# Altium schematic sheet StepperMotors.SchDoc
size A
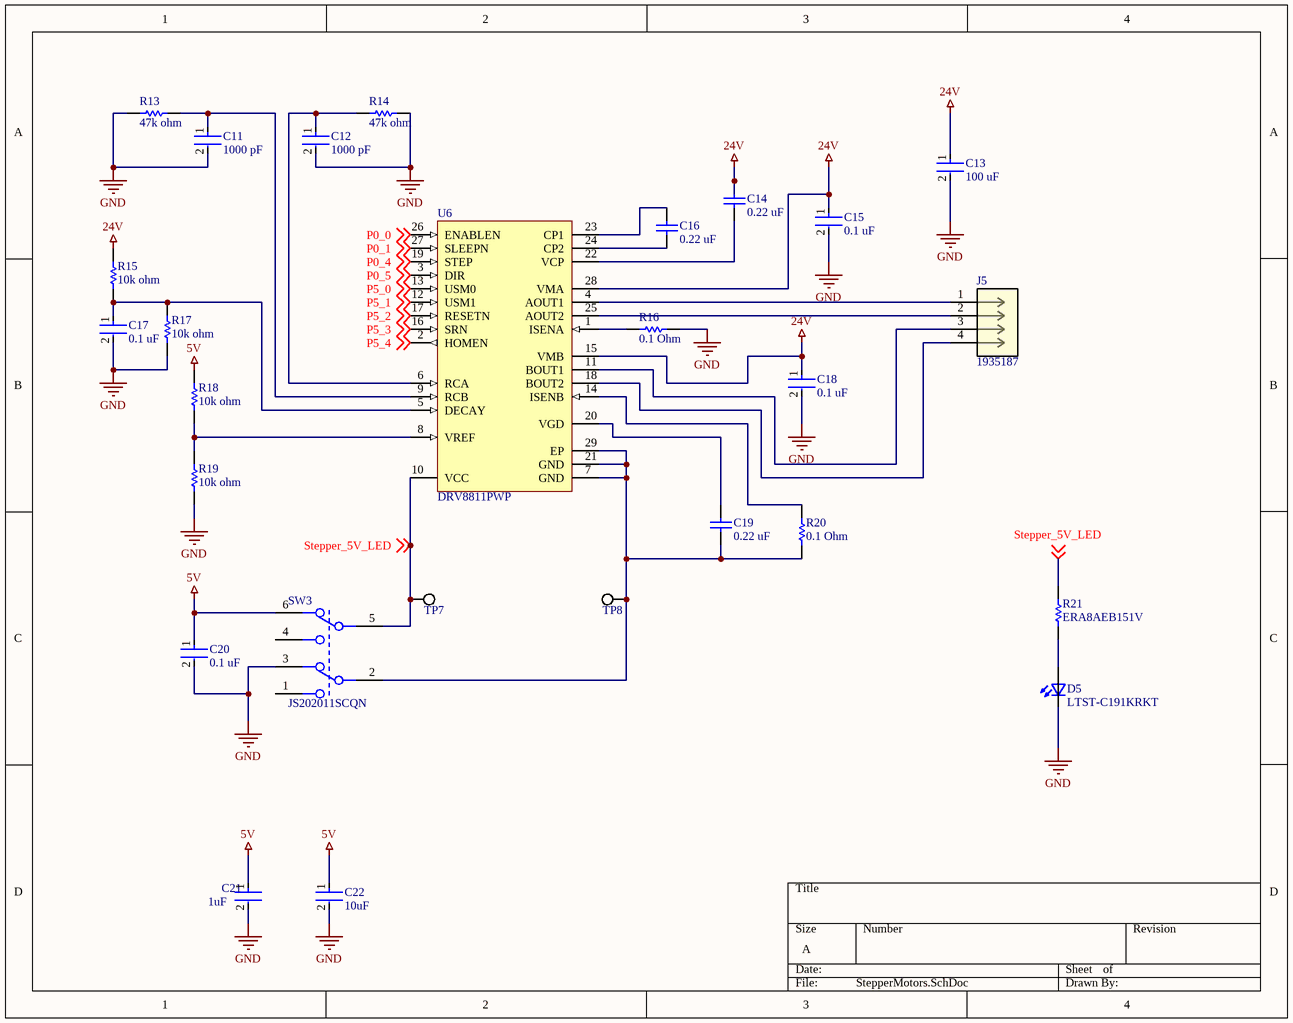
[diagram p0: StepperMotors.SchDoc]

## Parts
C11  1000 pF  [FP-0805-L_2_01_0_2-W_1_25-IPC_C]
C12  1000 pF  [FP-0805-L_2_01_0_2-W_1_25-IPC_C]
C13  100 uF  [FP-0805-L_2_0_0_2-W_1_25-IPC_A]
C14  0.22 uF  [CAPC2013X94X50ML20T25]
C15  0.1 uF  [FP-CL21-IPC_C]
C16  0.22 uF  [CAPC2013X94X50ML20T25]
C17  0.1 uF  [FP-CL21-IPC_C]
C18  0.1 uF  [FP-CL21-IPC_C]
C19  0.22 uF  [CAPC2013X94X50ML20T25]
C20  0.1 uF  [FP-CL21-IPC_C]
C21  1uF  [FP-CC0805-0_85-MFG]
C22  value 10uF  [FP-C0805C-DG-MFG]  (hidden comment: C0805C106K8PACTU)
D5  LTST-C191KRKT  [0603]
J5  1935187  [CONN_1935187_PXC]
R13  47k ohm  [RESC2013X70X40ML20T20]
R14  47k ohm  [RESC2013X70X40ML20T20]
R15  10k ohm  [RESC2013X60X35ML10T20]
R16  0.1 Ohm  [RESC2013X50X40ML20T20]
R17  10k ohm  [RESC2013X60X35ML10T20]
R18  10k ohm  [RESC2013X60X35ML10T20]
R19  10k ohm  [RESC2013X60X35ML10T20]
R20  0.1 Ohm  [RESC2013X50X40ML20T20]
R21  ERA8AEB151V  [RESC3216X70X50ML20T25]
SW3  JS202011SCQN  [FP-JS202011SCQN-MFG]
TP7  5019  [KSTN-5019_V]  (value not drawn)
TP8  5019  [KSTN-5019_V]  (value not drawn)
U6  DRV8811PWP  [PWP0028C_M]

## Nets
5V: C20.1 C21.1 C22.1 R18.2 SW3.6
24V: C13.1 C14.2 C15.1 C18.1 R15.2 U6.15(VMB) U6.28(VMA)
GND: C11.2 C12.2 C13.2 C15.2 C17.2 C18.2 C20.2 C21.2 C22.2 D5.1(K2) R13.1 R14.2 R16.2 R17.1 R19.1 SW3.3
P0_0: U6.26(ENABLEN) ; off-sheet P0_0
P0_1: U6.27(SLEEPN) ; off-sheet P0_1
P0_4: U6.19(STEP) ; off-sheet P0_4
P0_5: U6.3(DIR) ; off-sheet P0_5
P5_0: U6.13(USM0) ; off-sheet P5_0
P5_1: U6.12(USM1) ; off-sheet P5_1
P5_2: U6.17(RESETN) ; off-sheet P5_2
P5_3: U6.16(SRN) ; off-sheet P5_3
P5_4: U6.2(HOMEN) ; off-sheet P5_4
Stepper_5V_LED: R21.2 SW3.5 TP7.1 U6.10(VCC) ; off-sheet Stepper_5V_LED
NetC11_1: C11.1 R13.2 U6.9(RCB)
NetC12_1: C12.1 R14.1 U6.6(RCA)
NetC14_1: C14.1 U6.22(VCP)
NetC16_1: C16.1 U6.24(CP2)
NetC16_2: C16.2 U6.23(CP1)
NetC17_1: C17.1 R15.1 R17.2 U6.5(DECAY)
NetC19_1: C19.1 R20.1 SW3.2 TP8.1 U6.7(GND) U6.21(GND) U6.29(EP)
NetC19_2: C19.2 U6.20(VGD)
NetD5_2: D5.2(A2) R21.1
NetJ5_1: J5.1 U6.4(AOUT1)
NetJ5_2: J5.2 U6.25(AOUT2)
NetJ5_3: J5.3 U6.11(BOUT1)
NetJ5_4: J5.4 U6.18(BOUT2)
NetR16_1: R16.1 U6.1(ISENA)
NetR18_1: R18.1 R19.2 U6.8(VREF)
NetR20_2: R20.2 U6.14(ISENB)

Not connected (* = marked no-connect by the designer): SW3 1 4

## Library data of the parts
C11 C12 = CMP-2007-04270-2: General Purpose Ceramic Capacitor, 0805, 1nF, 5%, C0G, 30ppm/°C, 50V; Insulation Resistance: 100GR; Capacitance: 1nF; Voltage Rating (DC): 50V; Packaging: Tape and Reel; Min Operating Temperature: -55°C; Series: -; Construction: Flat; Tolerance: 5%; RoHS Compliant: Yes; Package Quantity: 1; Case Code (Metric): 2012; Lead Free: Lead Free; Thickness: 0.037inch; REACH SVHC: No SVHC; Temperature Coefficient: 30ppm/°C; Case/Package: 0805; Case Code: 0805; Radiation Hardening: No; Size: 0.94mm; Height: 0.94mm; Width: 0.049inch; Number of Pins: 2; Depth: 1.25mm; Dielectric: C0G; Contact Plating: Tin; Length: 2.01mm; Voltage: 50V; Voltage Rating: 50V; Max Operating Temperature: 125°C; Mount: Surface Mount; Case Code (Imperial): 0805; Termination: SMD/SMT
C13 = CMP-14477-004891-2: Multilayer Ceramic Capacitor 100uF 2.5V X5R 20% SMD 0805 T/R; Type: General Purpose; Voltage Rating: 2.5V; Case Code (Metric): 2012; Weight: 0.000194oz; Capacitance: 100uF; Termination: SMD/SMT; Case/Package: 0805; Dielectric: X5R; Tolerance: 20%; Package Quantity: 3000; Case Code (Imperial): 0805; Width: 1.25mm; Height: 1.25mm; Thickness: 0.053inch; Mount: Surface Mount; Min Operating Temperature: -55°C; Max Operating Temperature: 85°C; Voltage Rating (DC): 2.5V; Length: 0.079inch; Packaging: Tape and Reel; RoHS Compliant: Yes
C14 C16 C19 = CMP-2007-04189-1: Part Number: 08051C224KAT2A; Manufacturer: AVX Interconnect / Elco
C15 C17 C18 C20 = CMP-2000-05017-2: CL21 Series 0805 100nF 50V ±10% Tolerance X7R Multilayer Ceramic Chip Capacitor; Depth: 1.25mm; Height: 0.85mm; Width: 0.049inch; Tolerance: 10%; Case Code (Metric): 2012; Case Code (Imperial): 0805; Material: Ceramic; Thickness: 0.037inch; Min Operating Temperature: -55°C; Contact Plating: Tin; Length: 2mm; Mount: Surface Mount; Voltage Rating (DC): 50V; Lead Free: Lead Free; Dielectric: X7R; Radiation Hardening: No; Capacitance: 100nF; Voltage Rating: 50V; Case/Package: 0805; Packaging: Tape and Reel; Max Operating Temperature: 125°C; Voltage: 50V
C21 = CMP-03422-000182-1: CAP CER 1UF 10V X7R 0805; Manufacturer: Yageo; Manufacturer Part Number: CC0805KKX7R6BB105; Material: Ceramic; Tolerance: 0.1; Value: 1 uF; ComponentLink2URL: http://www.yageo.com/documents/recent/UPY-GPHC_Y5V_6.3V-to-50V_8.pdf; Automotive: No; Temperature Range Low: -30°C; Octopart: https://octopart.com/cc0805kkx7r6bb105-yageo-42522859; Temperature Characteristic: X7R; RoHS: TRUE; Voltage Rating: 10 V; Capacitance: 1 uF; Package: CC0805-0.85; Device Class L3: Ceramic Capacitors; Category: Cap; Mouser Description: Multilayer Ceramic Capacitors MLCC - SMD/SMT 1.0uF 10V X7R 10%; Temperature Range High: +85°C; Ipc Land Pattern Name: CAPC200125X85; ComponentLink2Description: Datasheet; Temperature: -30°C to +85°C; Height: 0.95mm; Lead Free: Yes; Device Class L1: Passive Components; Device Class L2: Capacitors; Footprint Url: http://www.yageo.com/exep/pages/download/literatures/UPY-C_GEN_24.pdf; Digikey Description: CAP CER 1UF 10V X7R 0805
C22 = CMP-2007-03243-2: CAP CER 10UF 10V X5R 0805; Manufacturer: Kemet; 3DS Part Number: 220-00001; Tolerance: 10%; Temperature Coefficient: 15%; Material: Ceramic; Device Class L2: Capacitors; Device Class L1: Passive Components; ComponentLink2URL: https://content.kemet.com/datasheets/KEM_C1006_X5R_SMD.pdf; Height: 1.4mm; Lead Free: Yes; Manufacturer Part Number: C0805C106K8PACTU; Digikey Description: CAP CER 10UF 10V X5R 0805; Octopart: https://octopart.com/c0805c106k8pactu-kemet-98697; Capacitance: 10uF; Temperature Range Low: -55°C; Temperature: -55°C to +85°C; Automotive: No; Mouser Description: CAP CER 10UF 10V X5R 0805; Ipc Land Pattern Name: CAPC200125X125; Temperature Range High: +85°C; Voltage: 10V; RoHS: TRUE; Device Class L3: Ceramic Capacitors; ComponentLink2Description: Datasheet; Voltage Rating: 10V; Package: C0805C-DG; Temperature Characteristic: X5R; Category: Cap; Supplier 1: Digi-Key; Supplier Part Number 1: 399-C0805C106K8PAC7800CT-ND; Manufacturer 1: KEMET; Manufacturer Part Number 1: C0805C106K8PACTU; Stock 1: 8631846; Pricing 1: 1=0.14000, 10=0.10300, 50=0.05840, 100=0.04830, 500=0.03388, 1000=0.02805 (USD); Mount: Surface Mount; Case/Package: 0805; Number of Pins: 2; Case Code (Imperial): 0805; Case Code (Metric): 2012; Dielectric Material: Ceramic; Contact Plating: Tin,Matte; Min Operating Temperature: -55°C; Max Operating Temperature: 85°C; Packaging: Tape and Reel; Dielectric: X5R; Package Quantity: 1; Voltage Rating (DC): 10V; Series: C; Termination: SMD/SMT; Construction: Flat; Dissipation Factor: 10%; Length: 2mm; Width: 1.2mm; Depth: 1.25mm; Thickness: 0.055inch; Radiation Hardening: No; REACH SVHC: No SVHC; RoHS Compliant: Yes
D5 = LTST-C191KRKT: http://octopart.com/ltst-c190krkt-lite-on-549893; Package: None; MP: LTST-C191KRKT; Value: *; Availability: Unavailable; Price: None
J5 = 1935187: No Description Available; Mfr_Name: Phoenix Contact; RefDes: RefDes; Type: Type
R13 R14 = CMP-2001-00421-1: Manufacturer: Panasonic; Part Number: ERJ-6GEYJ473V
R15 R17-R19 = CMP-2000-05025-1: Chip Resistor, 10 KOhm, +/- 5%, 0.125 W, -55 to 155 degC, 0805 (2012 Metric), RoHS, Tape and Reel; Manufacturer: Yageo; Resistor Element Type: ThickFilm; Voltage Rating: 150V; Product Range: RCSeries; SVHC: ToBeAdvised; Resistor Case Style: 0805[2012Metric]; Temperature Coefficient: ±100ppm/degC; Power Rating: 250mW; Resistance: 10kohm; Automotive Qualification Standard: -; Datasheet Version: REV. 2, 09/2004; Packaging: CutTape; Resistance Tolerance: ±5%; MSL: MSL1-Unlimited; Manufacturer URL: http://www.yageo.com/; Datasheet URL: http://www.yageo.ru/pdf/RC0805.pdf; Package Description: 2-Pin Surface Mounted Device, Body 2 x 1.25 mm; Package Reference: 805
R16 R20 = CMP-2001-03150-1: Manufacturer: Susumu; Part Number: RL1220S-R10-F
R21 = CMP-2003-04422-1: Manufacturer: Panasonic; Part Number: ERA8AEB151V
SW3 = CMP-2000-05087-3: SWITCH SLIDE DPDT 300MA 6V; Switch Function: On-On; Actuator Type: Standard; Switch Travel: 2mm; Actuator Color: Black; Contact Resistance: 70mR; Electrical Life: 5000Cycles; Actuator Material: Nylon; REACH SVHC: No SVHC; Series: JS; Min Operating Temperature: -20°C; Depth: 7.5mm; Housing Material: Nylon; Voltage Rating (DC): 6V; Max Operating Temperature: 85°C; Contact Current Rating: 300mA; Package Quantity: 1; Contact Plating: Silver; Contact Material: Copper Alloy; Throw Configuration: DPDT; Current Rating: 300mA; Orientation: Vertical; Max Current Rating: 300mA; Max Voltage Rating (DC): 6V; Flammability Rating: UL94 V-2; Length: 9mm; Packaging: Tape and Reel; Mount: Surface Mount; Actuator Length: 2mm; Lead Free: Lead Free; Termination: Gull Wing; Radiation Hardening: No
TP7 TP8 = CMP-1672-00008-1: Test Point, 1 Position SMD, RoHS, Tape and Reel; Manufacturer 1: Keystone Electronics; ComponentLink1Description: Manufacturer URL; Package Quantity: 1000; DatasheetVersion: 03/2014; Packaging: Tape and Reel; ComponentLink2URL: http://www.keyelco.com/product-pdf.cfm?p=1357; ComponentLink1URL: http://www.keyelco.com/; Mount: Surface Mount; Contact Plating: Silver; PackageDescription: 1-Pin Surface Mount Device, Body 3.81 x 2.03 mm; Pins: 1; RoHSCompliant: True; Mounting Technology: Surface Mount; ComponentLink2Description: Datasheet; PackageReference: 5019; Supplier 1: Digi-Key; Supplier Part Number 1: 36-5019CT-ND; Manufacturer Part Number 1: 5019; RoHS: Yes; Category: Connectors; Stock 1: 1316816; Pricing 1: 1=0.34000, 25=0.27360, 100=0.22340, 250=0.20064, 500=0.19152 (USD); Number of Pins: 1; Material: Bronze; Contact Material: Bronze; Series: 5019; Termination: SMD/SMT; Height: 0.09inch; RoHS Compliant: Yes; REACH SVHC: No SVHC; Lead Free: Lead Free; ComponentLink3URL: https://datasheet.ciiva.com/16318/m60-2p61-16318395.pdf?src-supplier=Future+Electronics; ComponentLink3Description: https://datasheet.ciiva.com/16318/m60-2p61-16318395.pdf?src-supplier=Future+Electronics; ComponentLink4URL: https://datasheet.ciiva.com/16885/70182998-16885945.pdf?src-supplier=Allied+Electronics; ComponentLink4Description: https://datasheet.ciiva.com/16885/70182998-16885945.pdf?src-supplier=Allied+Electronics; ComponentLink5URL: https://datasheet.ciiva.com/14848/m60-2p61-14848437.pdf?src-supplier=Digi-Key; ComponentLink5Description: https://datasheet.ciiva.com/14848/m60-2p61-14848437.pdf?src-supplier=Digi-Key; ComponentLink6URL: https://datasheet.ciiva.com/14848/m60-2p61-14848438.pdf?src-supplier=Digi-Key; ComponentLink6Description: https://datasheet.ciiva.com/14848/m60-2p61-14848438.pdf?src-supplier=Digi-Key; ComponentLink7URL: https://datasheet.ciiva.com/14848/m60-2p61-14848439.pdf?src-supplier=Digi-Key; ComponentLink7Description: https://datasheet.ciiva.com/14848/m60-2p61-14848439.pdf?src-supplier=Digi-Key
U6 = CMP-1556-00004-2: 1.9 A Bipolar Stepper Motor Driver with On-Chip 1 / 8 Microstepping Indexer (Step / Dir Ctrl), -40 to 85 degC, 28-pin HTSSOP (PWP), Green (RoHS & no Sb/Br); Thermal Shutdown: TRUE; Peak Output Current(A): 1.9; PackageVersion: 4073225-6/I, 05/2011; ComponentLink2URL: http://www.ti.com/general/docs/lit/getliterature.tsp?genericPartNumber=DRV8811&fileType=pdf; Eco-Plan: Green (RoHS & no Sb/Br); ComponentLink3URL: http://www.ti.com/litv/pdf/mpds373; PackageDescription: 28-Pin Plastic Small Outline, Body 9.70 x 4.40 mm, Pitch 0.65 mm; DatasheetVersion: SLVS865G; Code_JEDEC: MO-153; ComponentLink1URL: http://www.ti.com/; ComponentLink1Description: Manufacturer URL; ComponentLink2Description: Datasheet; Package Reference: PWP0028C; PartNumber: DRV8811PWP; Mounting Technology: Surface Mount; ComponentLink3Description: Package Specification